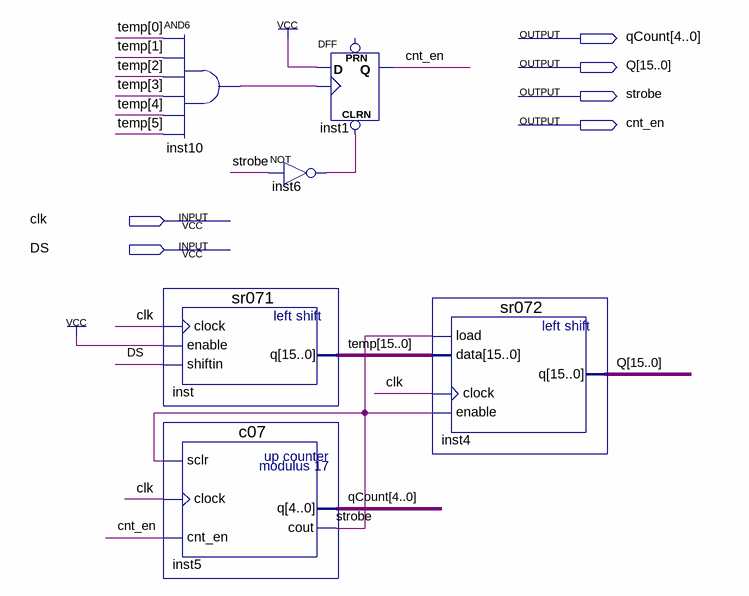
[diagram p0: schematic sheet]
// Quartus schematic b07.bdf as structural Verilog: 6 symbols, 6 pins
module b07 (
  input  clk,
  input  DS,
  output [4:0] qCount,
  output [15:0] Q,
  output strobe,
  output cnt_en
);

  wire inst6_out, inst10_out;
  wire [15:0] temp;

  and inst10 (inst10_out, temp[0], temp[1], temp[2], temp[3], temp[4], temp[5]);
  sr071 inst (.clock(clk), .enable(1'b1), .shiftin(DS), .q(temp));
  c07 inst5 (.sclr(strobe), .clock(clk), .cnt_en(cnt_en), .cout(strobe), .q(qCount));
  not inst6 (inst6_out, strobe);
  DFF inst1 (.CLRN(inst6_out), .CLK(inst10_out), .D(1'b1), .Q(cnt_en));  // open: PRN
  sr072 inst4 (.load(strobe), .data(temp), .clock(clk), .enable(strobe), .q(Q));
endmodule
